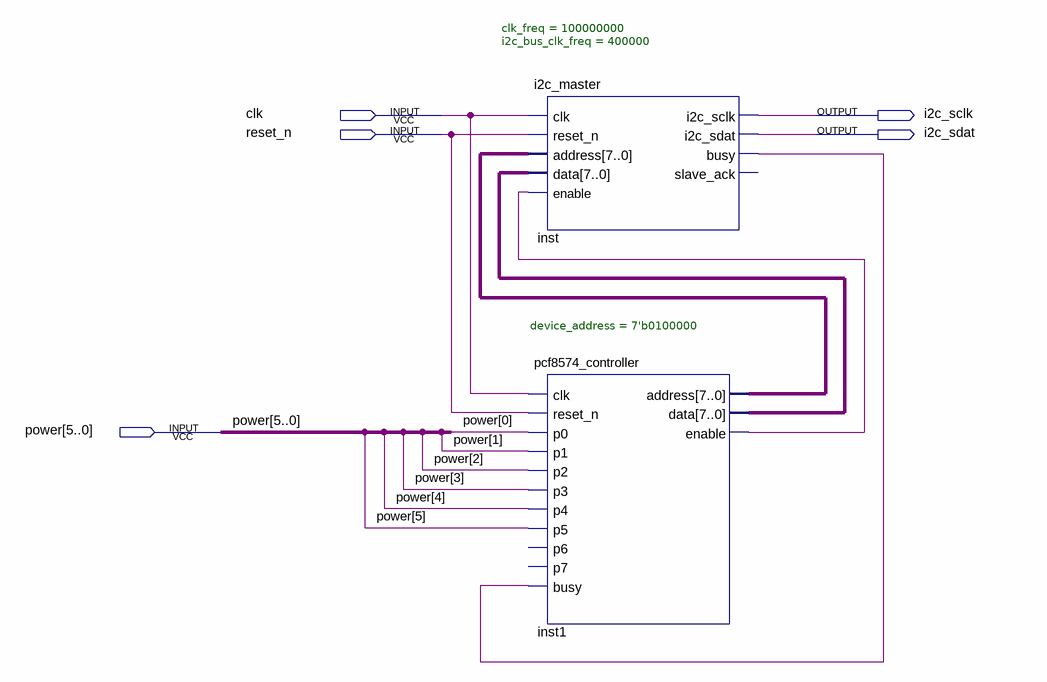
[diagram p0: schematic sheet]
// Quartus schematic module_power.bdf as structural Verilog: 2 symbols, 5 pins
module module_power (
  input  clk,
  input  reset_n,
  input  [5:0] power,
  output i2c_sclk,
  output i2c_sdat
);

  wire inst1_enable, inst_busy;
  wire [7:0] inst1_address, inst1_data;

  i2c_master #(.clk_freq(100000000), .i2c_bus_clk_freq(400000)) inst (
    .clk(clk), .reset_n(reset_n), .address(inst1_address), .data(inst1_data), .enable(inst1_enable),
    .i2c_sclk(i2c_sclk), .i2c_sdat(i2c_sdat), .busy(inst_busy));  // open: slave_ack
  pcf8574_controller #(.device_address(7'b0100000)) inst1 (
    .clk(clk), .reset_n(reset_n), .p0(power[0]), .p1(power[1]), .p2(power[2]), .p3(power[3]), .p4(power[4]),
    .p5(power[5]), .busy(inst_busy), .address(inst1_address), .data(inst1_data), .enable(inst1_enable));  // open: p6, p7
endmodule
